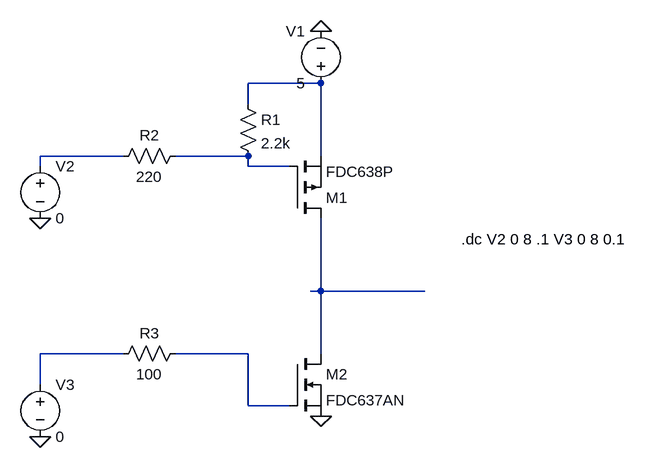
[diagram p0: schematic MotorControl.asc]
MotorControl.asc, the LTspice schematic file:
Version 4
SHEET 1 880 740
WIRE 208 176 96 176
WIRE 96 208 96 176
WIRE -96 288 -224 288
WIRE 96 288 -16 288
WIRE 208 288 208 176
WIRE -224 304 -224 288
WIRE 96 304 96 288
WIRE 160 304 96 304
WIRE 208 496 208 384
WIRE 208 496 192 496
WIRE 368 496 208 496
WIRE -96 592 -224 592
WIRE 96 592 -16 592
WIRE 208 592 208 496
WIRE -224 640 -224 592
WIRE 96 672 96 592
WIRE 160 672 96 672
FLAG 208 96 0
FLAG 208 688 0
FLAG -224 384 0
FLAG -224 720 0
SYMBOL voltage 208 192 R180
WINDOW 0 24 96 Left 2
WINDOW 3 24 16 Left 2
WINDOW 123 0 0 Left 2
WINDOW 39 0 0 Left 2
SYMATTR InstName V1
SYMATTR Value 5
SYMBOL res 80 192 R0
SYMATTR InstName R1
SYMATTR Value 2.2k
SYMBOL pmos 160 384 M180
SYMATTR InstName M1
SYMATTR Value FDC638P
SYMBOL res 0 272 R90
WINDOW 0 0 56 VBottom 2
WINDOW 3 32 56 VTop 2
SYMATTR InstName R2
SYMATTR Value 220
SYMBOL res 0 576 R90
WINDOW 0 0 56 VBottom 2
WINDOW 3 32 56 VTop 2
SYMATTR InstName R3
SYMATTR Value 100
SYMBOL nmos 160 592 R0
SYMATTR InstName M2
SYMATTR Value FDC637AN
SYMBOL voltage -224 288 R0
WINDOW 123 0 0 Left 2
WINDOW 39 0 0 Left 2
SYMATTR InstName V2
SYMATTR Value 0
SYMBOL voltage -224 624 R0
WINDOW 123 0 0 Left 2
WINDOW 39 0 0 Left 2
SYMATTR InstName V3
SYMATTR Value 0
TEXT 424 416 Left 2 !.dc V2 0 8 .1 V3 0 8 0.1

The netlist it stands for:
* MotorControl.asc
V1 N001 0 5
R1 N001 N003 2.2k
M1 N004 N003 N001 N001 FDC638P
R2 N003 N002 220
R3 N006 N005 100
M2 N004 N006 0 0 FDC637AN
V2 N002 0 0
V3 N005 0 0
.model NMOS NMOS
.model PMOS PMOS
.lib standard.mos
.dc V2 0 8 .1 V3 0 8 0.1
.backanno
.end